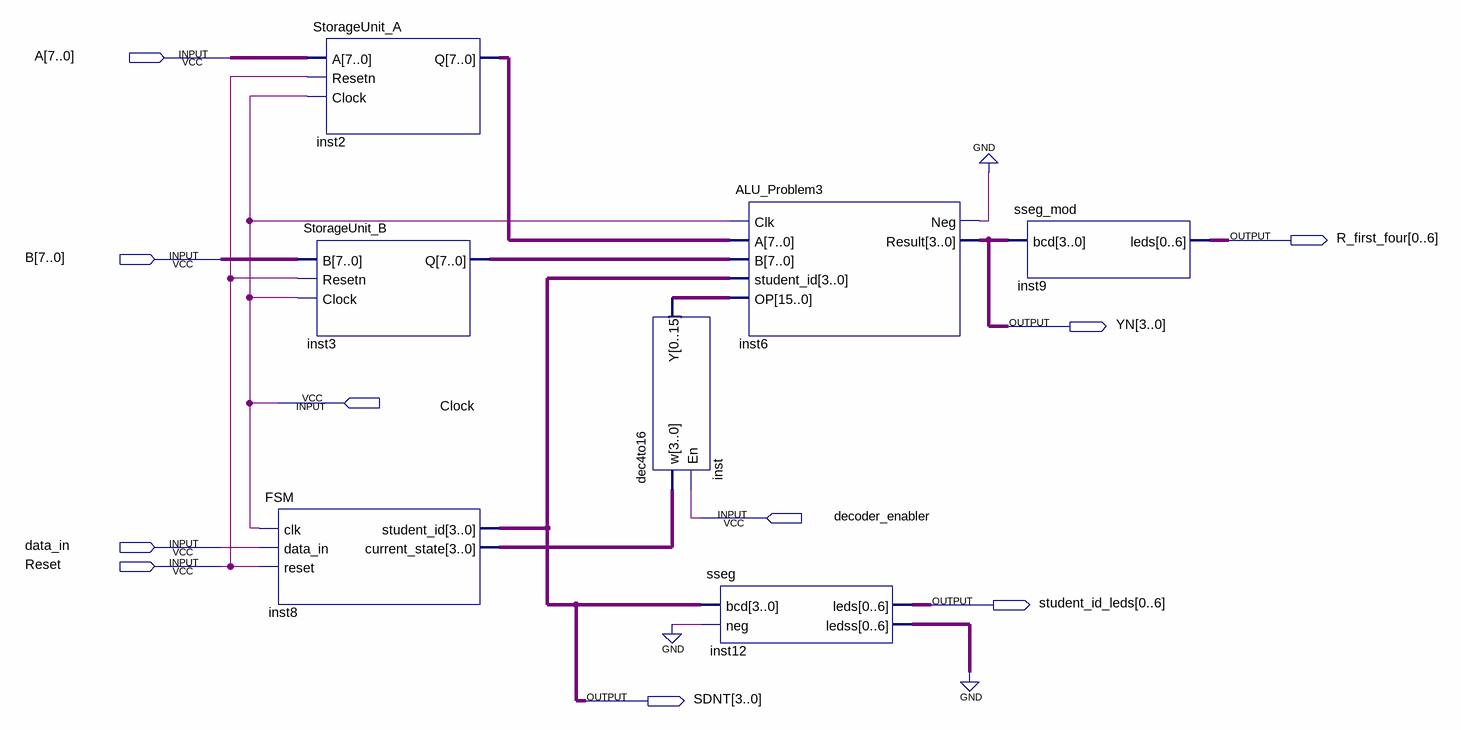
[diagram p0: schematic sheet]
// Quartus schematic Lab6_problem3.bdf as structural Verilog: 7 symbols, 10 pins
module Lab6_problem3 (
  input  [7:0] A,
  input  [7:0] B,
  input  Clock,
  input  decoder_enabler,
  input  data_in,
  input  Reset,
  output [0:6] R_first_four,
  output [3:0] YN,
  output [0:6] student_id_leds,
  output [3:0] SDNT
);

  wire inst6_neg;
  wire [3:0] inst8_current_state;
  wire [6:0] inst12_ledss;
  wire [7:0] inst2_q, inst3_q;
  wire [15:0] inst_y;

  FSM inst8 (.clk(Clock), .data_in(data_in), .reset(Reset), .student_id(SDNT), .current_state(inst8_current_state));
  StorageUnit_A inst2 (.A(A), .Resetn(Reset), .Clock(Clock), .Q(inst2_q));
  StorageUnit_B inst3 (.B(B), .Resetn(Reset), .Clock(Clock), .Q(inst3_q));
  dec4to16 inst (.w(inst8_current_state), .En(decoder_enabler), .Y(inst_y));
  ALU_Problem3 inst6 (
    .Clk(Clock), .A(inst2_q), .B(inst3_q), .student_id(SDNT), .OP(inst_y), .Neg(inst6_neg), .Result(YN));
  sseg inst12 (.bcd(SDNT), .neg(1'b0), .leds(student_id_leds), .ledss(inst12_ledss));
  sseg_mod inst9 (.bcd(YN), .leds(R_first_four));
  // also tied to GND on the sheet: {inst6_neg, inst12_ledss[0], inst12_ledss[1], inst12_ledss[2], inst12_ledss[3], inst12_ledss[4], inst12_ledss[5], inst12_ledss[6]}
endmodule
